# Altium project Orbit_PA_dev.PrjPcb
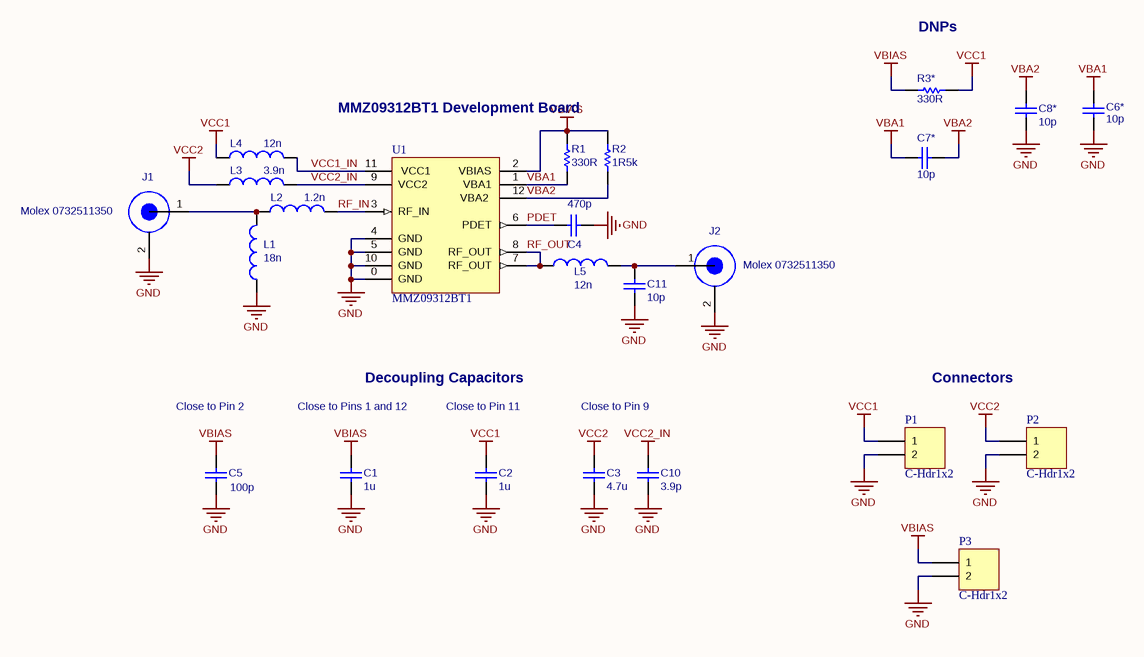
[diagram p0: Orbit_PA_dev.SchDoc]
1 sheet, 24 parts. Net scope: global (net labels, ports and power ports of the same name join across sheets).
Board file: orbit_PA_devboard.PcbDoc

## Sheet Orbit_PA_dev.SchDoc: UBC Orbit Power Amplifier Development Board
size A4; DrawnBy: UBC Orbit; DocumentNumber: 1; Revision: 0.0; SheetNumber: 1; SheetTotal: 1

### Parts
C1  1u  [CAP 1005 (0402) B-Density]
C2  1u  [CAP 1005 (0402) B-Density]
C3  4.7u  [CAP 1608 (0603) B-Density]
C4  470p  [CAP 1005 (0402) B-Density]
C5  100p  [CAP 1005 (0402) B-Density]
C6*  10p  [CAP 1005 (0402) B-Density]
C7*  10p  [CAP 1005 (0402) B-Density]
C8*  10p  [CAP 1005 (0402) B-Density]
C10  3.9p  [CAP 1005 (0402) B-Density]
C11  10p  [CAP 1005 (0402) B-Density]
J1  Molex 0732511350  [MOLEX 732511350]
J2  Molex 0732511350  [MOLEX 732511350]
L1  18n  [IND 1608 (0603)]
L2  1.2n  [IND 1608 (0603)]
L3  3.9n  [IND 1608 (0603)]
L4  12n  [IND 1608 (0603)]
L5  12n  [IND 1608 (0603)]
P1  C-Hdr1x2  [HDR1X2_LGE1.0]
P2  C-Hdr1x2  [HDR1X2_LGE1.0]
P3  C-Hdr1x2  [HDR1X2_LGE1.0]
R1  330R  [RES 1005 (0402)]
R2  1R5k  [RES 1005 (0402)]
R3*  330R  [RES 1005 (0402)]
U1  MMZ09312BT1  [QFN 3x3]

### Nets
GND: C1.1 C2.1 C3.1 C4.2 C5.1 C6*.1 C8*.1 C10.1 C11.1 J1.2 J2.2 L1.1 P1.2 P2.2 P3.2 U1.0(GND) U1.4(GND) U1.5(GND) U1.10(GND)
VBA1: C6*.2 C7*.2 R1.1 U1.1(VBA1)
VBA2: C7*.1 C8*.2 R2.1 U1.12(VBA2)
VBIAS: C1.2 C5.2 P3.1 R1.2 R2.2 R3*.2 U1.2(VBIAS)
VCC1: C2.2 L4.1 P1.1 R3*.1
VCC2: C3.2 L3.1 P2.1
VCC2_IN: C10.2 L3.2 U1.9(VCC2)
PDET: C4.1 U1.6(PDET)
RF_IN: L2.2 U1.3(RF_IN)
RF_OUT: L5.1 U1.7(RF_OUT) U1.8(RF_OUT)
VCC1_IN: L4.2 U1.11(VCC1)
NetC11_2: C11.2 J2.1 L5.2
NetJ1_1: J1.1 L1.2 L2.1

### Notes on the sheet
- DNPs
- (near R1) MMZ09312BT1 Development Board
- Close to Pin 2
- Close to Pins 1 and 12
- Decoupling Capacitors
- Close to Pin 11
- Close to Pin 9
- Connectors

### Library data of the parts
C1-C5 C6* C7* C8* C10 C11 = CAPACITOR (GENERAL): Capacitor; Supplier 1: Digi-Key
  C1: Supplier Part Number 1: 1276-1076-1-ND; Value: 1u
  C2: Supplier Part Number 1: 1276-1076-1-ND; Value: *
  C3: Supplier Part Number 1: 490-7203-1-ND; Value: *
  C4: Supplier Part Number 1: 490-1297-1-ND; Value: *
  C5: Supplier Part Number 1: 399-3194-1-ND; Value: *
  C6* C7* C8* C11: Supplier Part Number 1: 490-3113-1-ND; Value: *
  C10: Supplier Part Number 1: 478-4424-1-ND; Value: *
J1 J2 = SMA CONNECTOR (GENERAL): Supplier 1: Digi-Key; Supplier Part Number 1: WM9357-ND
L1-L5 = INDUCTOR (GENERAL): Inductor; Supplier 1: Digi-Key; Value: *
  L1: Supplier Part Number 1: 490-6577-1-ND
  L2: Supplier Part Number 1: 490-1099-1-ND
  L3: Supplier Part Number 1: 490-1105-1-ND
  L4 L5: Supplier Part Number 1: 490-17900-1-ND
P1-P3 = C-Hdr1x2: Header, 2-Pin; LatestRevisionDate: 17-Jul-2002; LatestRevisionNote: Re-released for DXP Platform.; Publisher: Altium Limited; Supplier 1: Digi-Key; Supplier Part Number 1: 732-5315-ND
R1 R2 R3* = RESISTOR (GENERAL): Resistor; Supplier 1: Digi-Key; Value: *
  R1 R3*: Supplier Part Number 1: 311-330JRCT-ND
  R2: Supplier Part Number 1: 311-1.50KLRCT-ND
U1 = MMZ09312BT1: IC RF AMP CDMA 400MHZ-1GHZ 12QFN; Supplier 1: Digi-Key; Supplier Part Number 1: MMZ09312BT1TR-ND